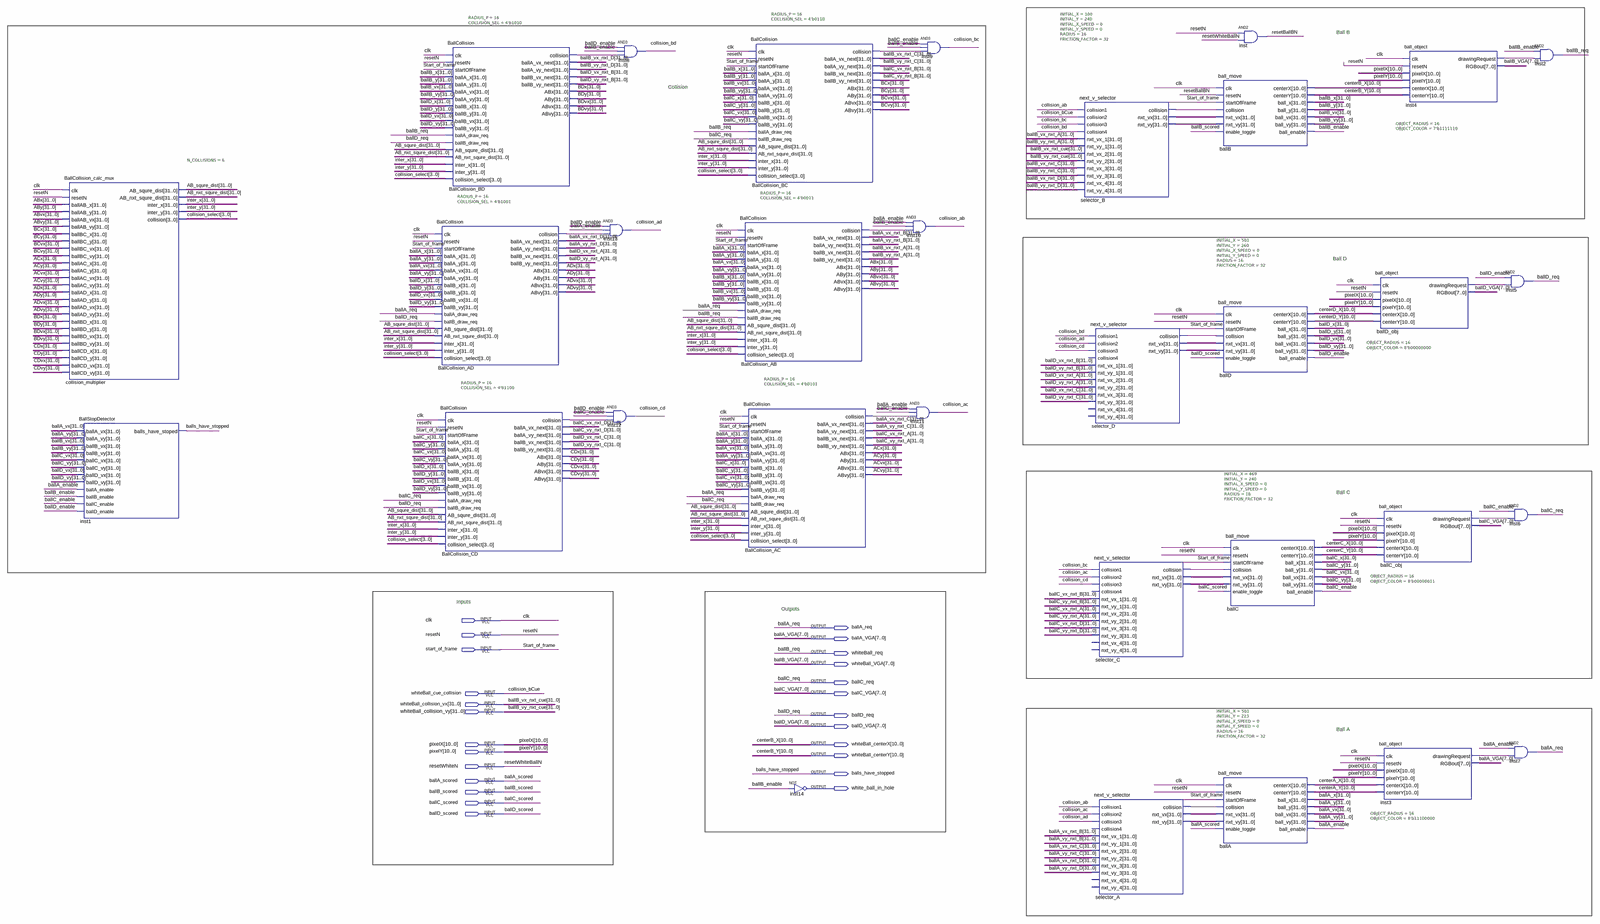
[diagram p0: schematic sheet, whole]
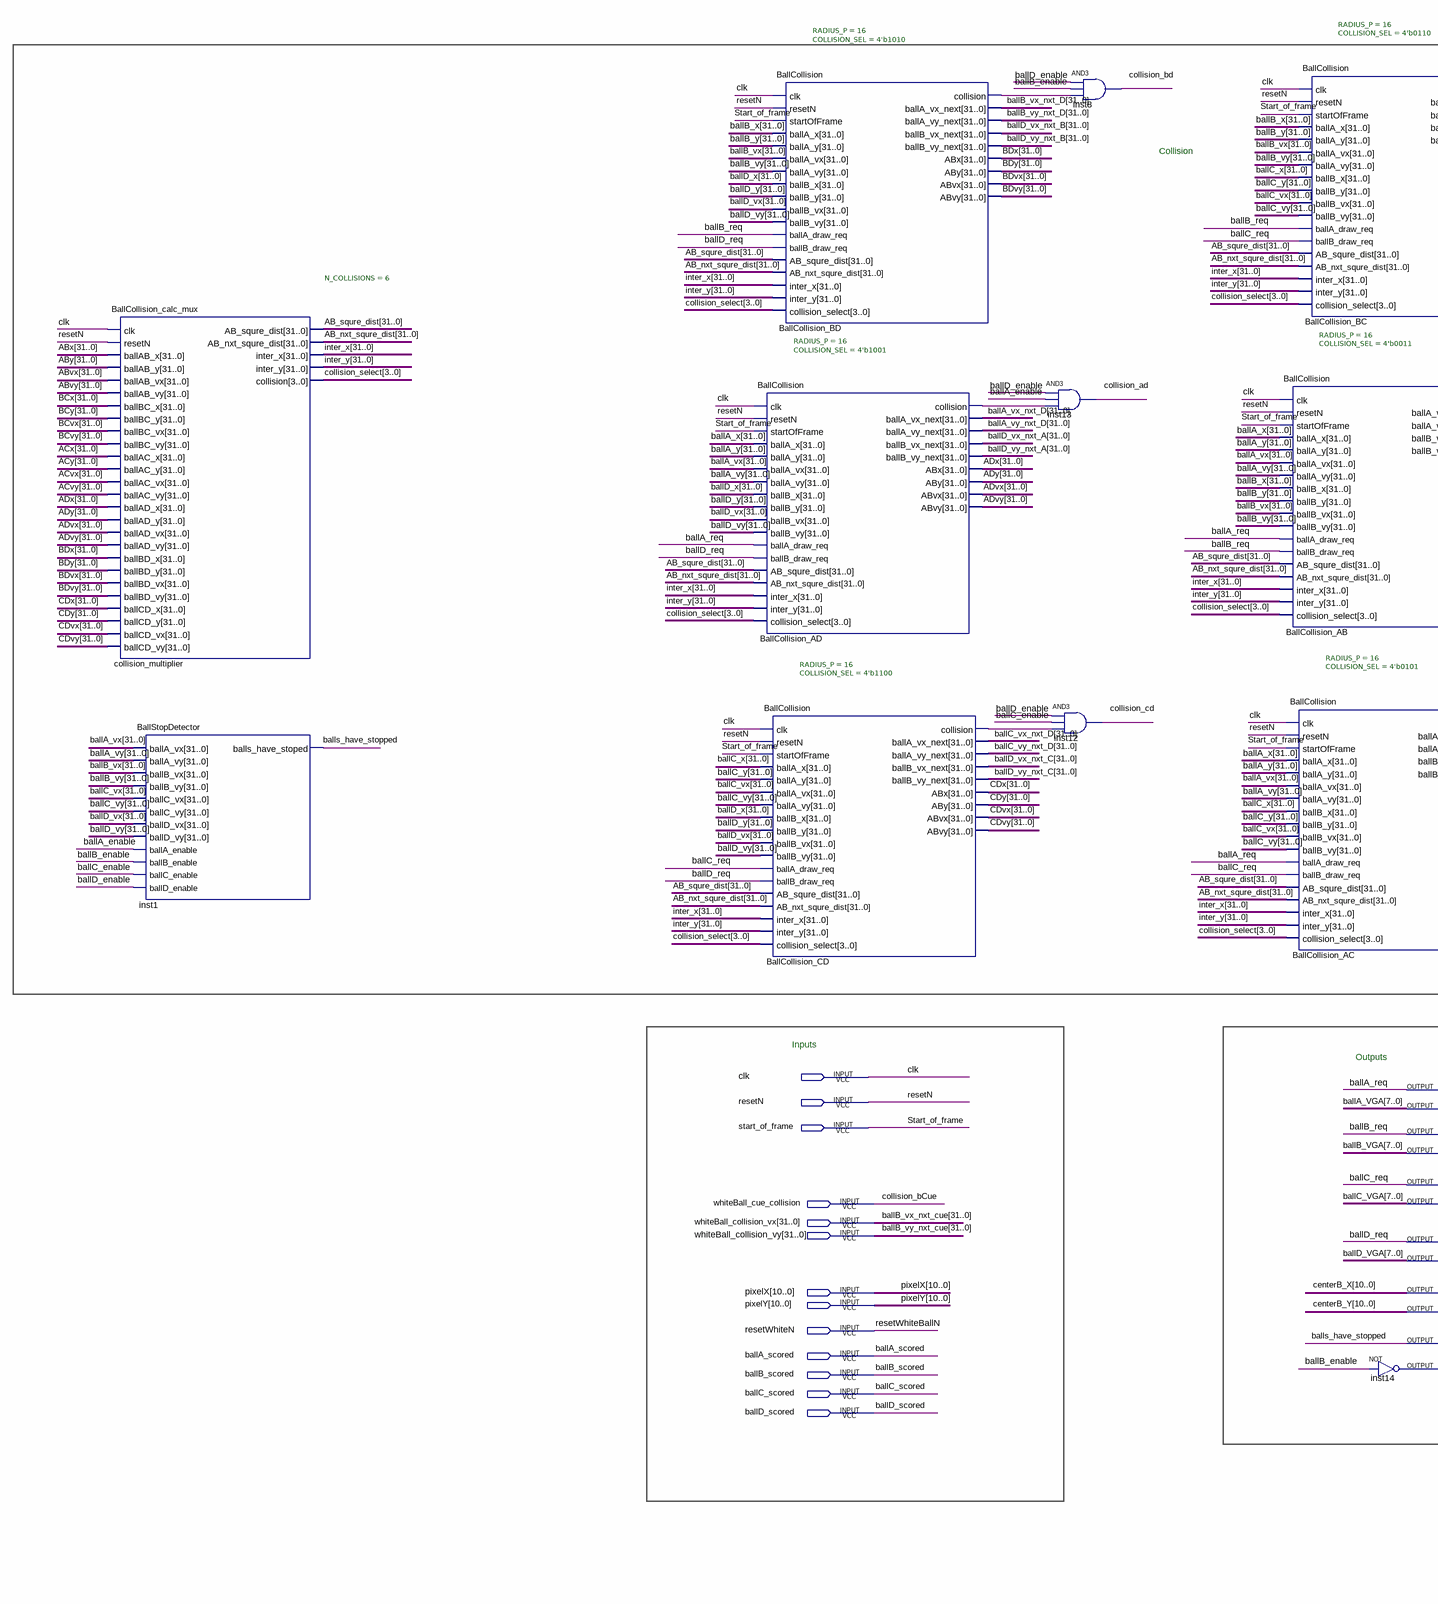
[diagram p1: schematic sheet, left part]
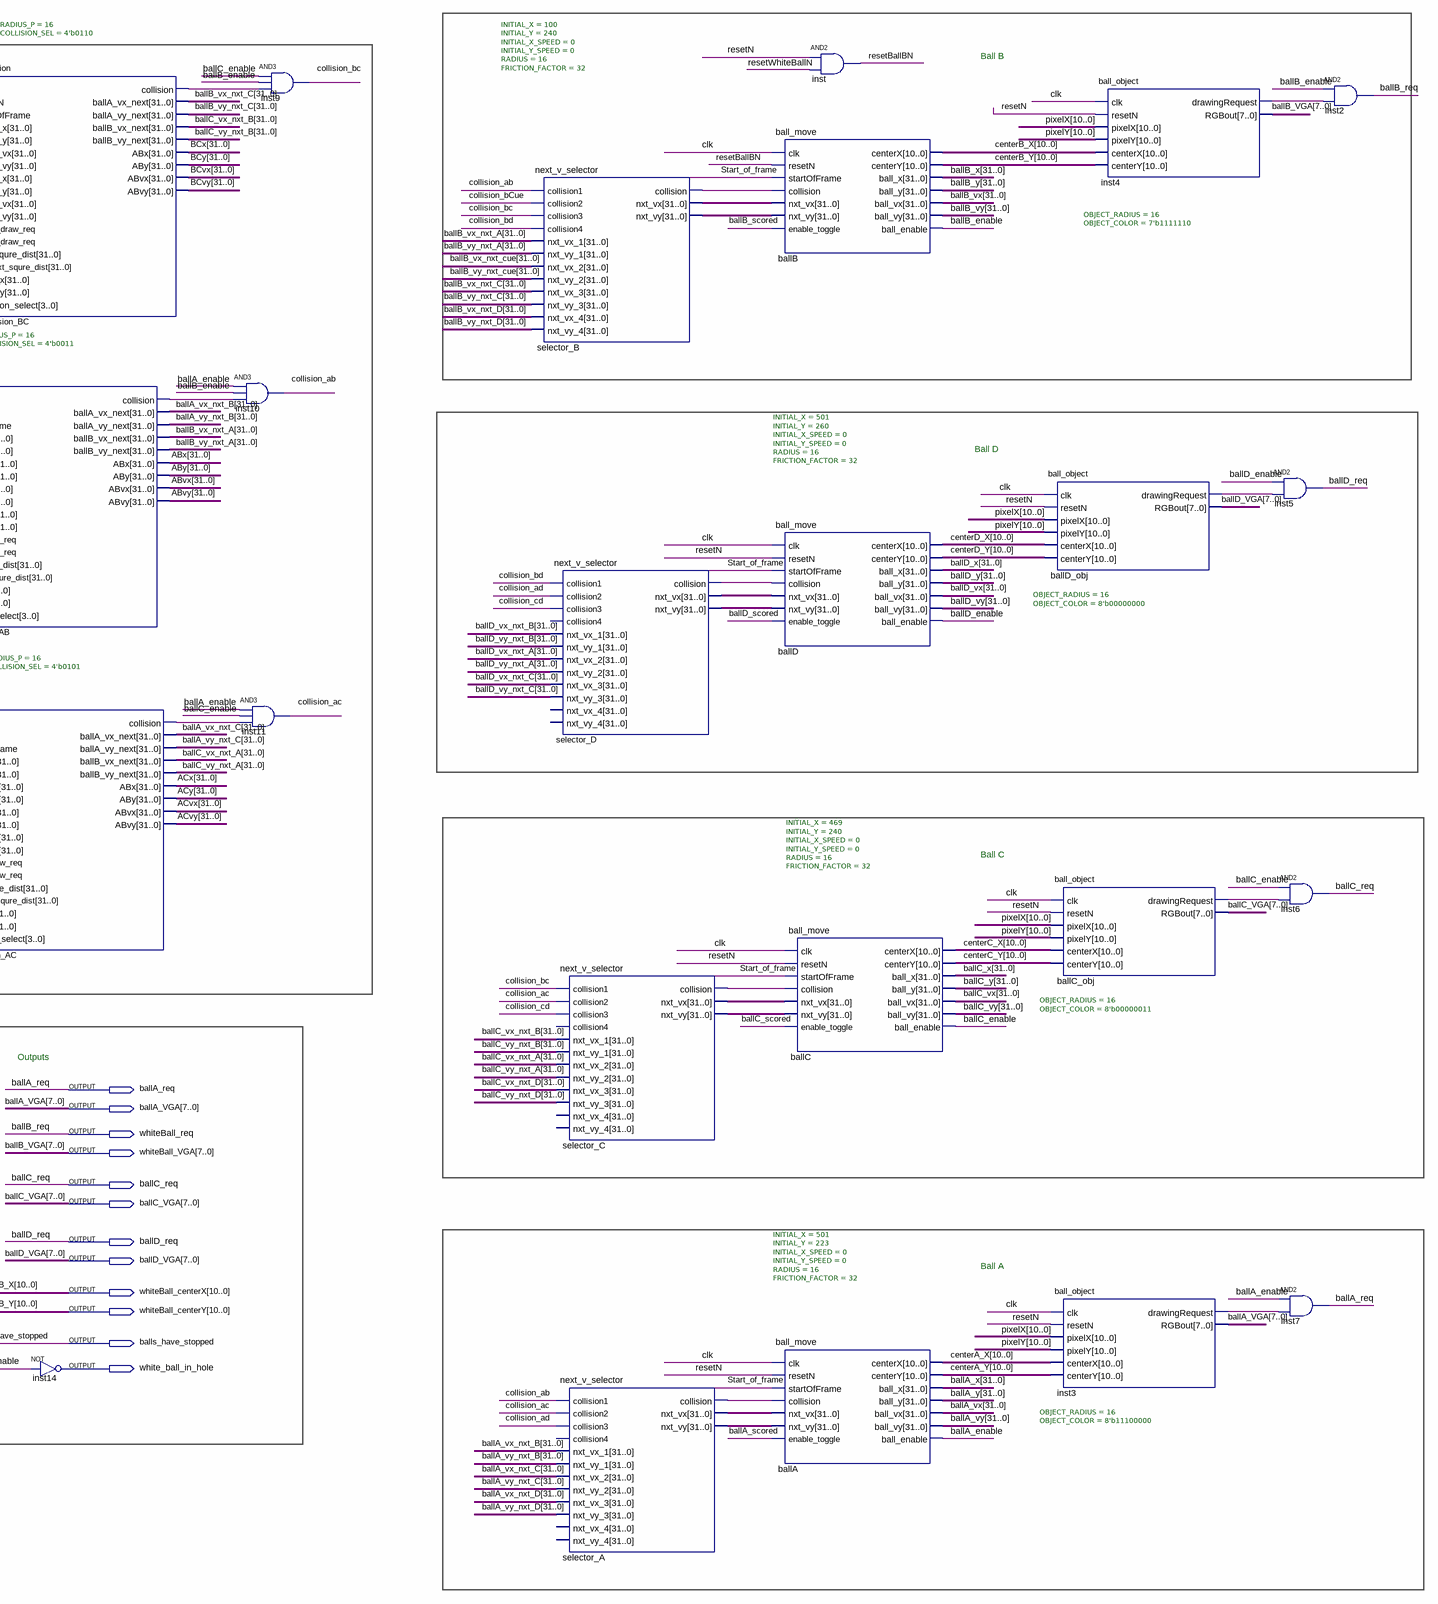
[diagram p2: schematic sheet, right part]
// Quartus schematic BALLS_TOP.bdf as structural Verilog: 32 symbols, 25 pins
module BALLS_TOP (
  input  clk,
  input  resetN,
  input  start_of_frame,
  input  whiteBall_cue_collision,
  input  [31:0] whiteBall_collision_vx,
  input  [31:0] whiteBall_collision_vy,
  input  [10:0] pixelX,
  input  [10:0] pixelY,
  input  resetWhiteN,
  input  ballA_scored,
  input  ballB_scored,
  input  ballC_scored,
  input  ballD_scored,
  output ballA_req,
  output [7:0] ballA_VGA,
  output whiteBall_req,
  output [7:0] whiteBall_VGA,
  output ballC_req,
  output [7:0] ballC_VGA,
  output ballD_req,
  output [7:0] ballD_VGA,
  output [10:0] whiteBall_centerX,
  output [10:0] whiteBall_centerY,
  output balls_have_stopped,
  output white_ball_in_hole
);

  wire ballA_enable, ballB_enable, ballC_enable, ballC_obj_drawingrequest, BallCollision_AB_collision,
       BallCollision_AC_collision, BallCollision_AD_collision, BallCollision_BC_collision,
       BallCollision_BD_collision, BallCollision_CD_collision, ballD_enable, ballD_obj_drawingrequest,
       collision_ab, collision_ac, collision_ad, collision_bc, collision_bd, collision_cd,
       inst3_drawingrequest, inst4_drawingrequest, resetBallBN, selector_A_collision, selector_B_collision,
       selector_C_collision, selector_D_collision;
  wire [3:0] collision_select;
  wire [10:0] centerA_X, centerA_Y, centerC_X, centerC_Y, centerD_X, centerD_Y;
  wire [31:0] AB_nxt_squre_dist, AB_squre_dist, ABvx, ABvy, ABx, ABy, ACvx, ACvy, ACx, ACy, ADvx, ADvy, ADx,
       ADy, ballA_vx, ballA_vx_nxt_B, ballA_vx_nxt_C, ballA_vx_nxt_D, ballA_vy, ballA_vy_nxt_B,
       ballA_vy_nxt_C, ballA_vy_nxt_D, ballA_x, ballA_y, ballB_vx, ballB_vx_nxt_A, ballB_vx_nxt_C,
       ballB_vx_nxt_D, ballB_vy, ballB_vy_nxt_A, ballB_vy_nxt_C, ballB_vy_nxt_D, ballB_x, ballB_y, ballC_vx,
       ballC_vx_nxt_A, ballC_vx_nxt_B, ballC_vx_nxt_D, ballC_vy, ballC_vy_nxt_A, ballC_vy_nxt_B,
       ballC_vy_nxt_D, ballC_x, ballC_y, ballD_vx, ballD_vx_nxt_A, ballD_vx_nxt_B, ballD_vx_nxt_C, ballD_vy,
       ballD_vy_nxt_A, ballD_vy_nxt_B, ballD_vy_nxt_C, ballD_x, ballD_y, BCvx, BCvy, BCx, BCy, BDvx, BDvy,
       BDx, BDy, CDvx, CDvy, CDx, CDy, inter_x, inter_y, selector_A_nxt_vx, selector_A_nxt_vy,
       selector_B_nxt_vx, selector_B_nxt_vy, selector_C_nxt_vx, selector_C_nxt_vy, selector_D_nxt_vx,
       selector_D_nxt_vy;

  BallCollision_calc_mux #(.N_COLLISIONS(6)) collision_multiplier (
    .clk(clk), .resetN(resetN), .ballAB_x(ABx), .ballAB_y(ABy), .ballAB_vx(ABvx), .ballAB_vy(ABvy),
    .ballBC_x(BCx), .ballBC_y(BCy), .ballBC_vx(BCvx), .ballBC_vy(BCvy), .ballAC_x(ACx), .ballAC_y(ACy),
    .ballAC_vx(ACvx), .ballAC_vy(ACvy), .ballAD_x(ADx), .ballAD_y(ADy), .ballAD_vx(ADvx), .ballAD_vy(ADvy),
    .ballBD_x(BDx), .ballBD_y(BDy), .ballBD_vx(BDvx), .ballBD_vy(BDvy), .ballCD_x(CDx), .ballCD_y(CDy),
    .ballCD_vx(CDvx), .ballCD_vy(CDvy), .AB_squre_dist(AB_squre_dist), .AB_nxt_squre_dist(AB_nxt_squre_dist),
    .inter_x(inter_x), .inter_y(inter_y), .collision(collision_select));
  BallStopDetector inst1 (
    .ballA_vx(ballA_vx), .ballA_vy(ballA_vy), .ballB_vx(ballB_vx), .ballB_vy(ballB_vy), .ballC_vx(ballC_vx),
    .ballC_vy(ballC_vy), .ballD_vx(ballD_vx), .ballD_vy(ballD_vy), .ballA_enable(ballA_enable),
    .ballB_enable(ballB_enable), .ballC_enable(ballC_enable), .ballD_enable(ballD_enable),
    .balls_have_stoped(balls_have_stopped));
  BallCollision #(.RADIUS_P(16), .COLLISION_SEL(4'b1001)) BallCollision_AD (
    .clk(clk), .resetN(resetN), .startOfFrame(start_of_frame), .ballA_x(ballA_x), .ballA_y(ballA_y),
    .ballA_vx(ballA_vx), .ballA_vy(ballA_vy), .ballB_x(ballD_x), .ballB_y(ballD_y), .ballB_vx(ballD_vx),
    .ballB_vy(ballD_vy), .ballA_draw_req(ballA_req), .ballB_draw_req(ballD_req),
    .AB_squre_dist(AB_squre_dist), .AB_nxt_squre_dist(AB_nxt_squre_dist), .inter_x(inter_x),
    .inter_y(inter_y), .collision_select(collision_select), .collision(BallCollision_AD_collision),
    .ballA_vx_next(ballA_vx_nxt_D), .ballA_vy_next(ballA_vy_nxt_D), .ballB_vx_next(ballD_vx_nxt_A),
    .ballB_vy_next(ballD_vy_nxt_A), .ABx(ADx), .ABy(ADy), .ABvx(ADvx), .ABvy(ADvy));
  BallCollision #(.RADIUS_P(16), .COLLISION_SEL(4'b1100)) BallCollision_CD (
    .clk(clk), .resetN(resetN), .startOfFrame(start_of_frame), .ballA_x(ballC_x), .ballA_y(ballC_y),
    .ballA_vx(ballC_vx), .ballA_vy(ballC_vy), .ballB_x(ballD_x), .ballB_y(ballD_y), .ballB_vx(ballD_vx),
    .ballB_vy(ballD_vy), .ballA_draw_req(ballC_req), .ballB_draw_req(ballD_req),
    .AB_squre_dist(AB_squre_dist), .AB_nxt_squre_dist(AB_nxt_squre_dist), .inter_x(inter_x),
    .inter_y(inter_y), .collision_select(collision_select), .collision(BallCollision_CD_collision),
    .ballA_vx_next(ballC_vx_nxt_D), .ballA_vy_next(ballC_vy_nxt_D), .ballB_vx_next(ballD_vx_nxt_C),
    .ballB_vy_next(ballD_vy_nxt_C), .ABx(CDx), .ABy(CDy), .ABvx(CDvx), .ABvy(CDvy));
  BallCollision #(.RADIUS_P(16), .COLLISION_SEL(4'b1010)) BallCollision_BD (
    .clk(clk), .resetN(resetN), .startOfFrame(start_of_frame), .ballA_x(ballB_x), .ballA_y(ballB_y),
    .ballA_vx(ballB_vx), .ballA_vy(ballB_vy), .ballB_x(ballD_x), .ballB_y(ballD_y), .ballB_vx(ballD_vx),
    .ballB_vy(ballD_vy), .ballA_draw_req(whiteBall_req), .ballB_draw_req(ballD_req),
    .AB_squre_dist(AB_squre_dist), .AB_nxt_squre_dist(AB_nxt_squre_dist), .inter_x(inter_x),
    .inter_y(inter_y), .collision_select(collision_select), .collision(BallCollision_BD_collision),
    .ballA_vx_next(ballB_vx_nxt_D), .ballA_vy_next(ballB_vy_nxt_D), .ballB_vx_next(ballD_vx_nxt_B),
    .ballB_vy_next(ballD_vy_nxt_B), .ABx(BDx), .ABy(BDy), .ABvx(BDvx), .ABvy(BDvy));
  and inst13 (collision_ad, ballD_enable, ballA_enable, BallCollision_AD_collision);
  and inst12 (collision_cd, ballD_enable, ballC_enable, BallCollision_CD_collision);
  and inst8 (collision_bd, ballD_enable, ballB_enable, BallCollision_BD_collision);
  BallCollision #(.RADIUS_P(16), .COLLISION_SEL(4'b0110)) BallCollision_BC (
    .clk(clk), .resetN(resetN), .startOfFrame(start_of_frame), .ballA_x(ballB_x), .ballA_y(ballB_y),
    .ballA_vx(ballB_vx), .ballA_vy(ballB_vy), .ballB_x(ballC_x), .ballB_y(ballC_y), .ballB_vx(ballC_vx),
    .ballB_vy(ballC_vy), .ballA_draw_req(whiteBall_req), .ballB_draw_req(ballC_req),
    .AB_squre_dist(AB_squre_dist), .AB_nxt_squre_dist(AB_nxt_squre_dist), .inter_x(inter_x),
    .inter_y(inter_y), .collision_select(collision_select), .collision(BallCollision_BC_collision),
    .ballA_vx_next(ballB_vx_nxt_C), .ballA_vy_next(ballB_vy_nxt_C), .ballB_vx_next(ballC_vx_nxt_B),
    .ballB_vy_next(ballC_vy_nxt_B), .ABx(BCx), .ABy(BCy), .ABvx(BCvx), .ABvy(BCvy));
  BallCollision #(.RADIUS_P(16), .COLLISION_SEL(4'b0011)) BallCollision_AB (
    .clk(clk), .resetN(resetN), .startOfFrame(start_of_frame), .ballA_x(ballA_x), .ballA_y(ballA_y),
    .ballA_vx(ballA_vx), .ballA_vy(ballA_vy), .ballB_x(ballB_x), .ballB_y(ballB_y), .ballB_vx(ballB_vx),
    .ballB_vy(ballB_vy), .ballA_draw_req(ballA_req), .ballB_draw_req(whiteBall_req),
    .AB_squre_dist(AB_squre_dist), .AB_nxt_squre_dist(AB_nxt_squre_dist), .inter_x(inter_x),
    .inter_y(inter_y), .collision_select(collision_select), .collision(BallCollision_AB_collision),
    .ballA_vx_next(ballA_vx_nxt_B), .ballA_vy_next(ballA_vy_nxt_B), .ballB_vx_next(ballB_vx_nxt_A),
    .ballB_vy_next(ballB_vy_nxt_A), .ABx(ABx), .ABy(ABy), .ABvx(ABvx), .ABvy(ABvy));
  BallCollision #(.RADIUS_P(16), .COLLISION_SEL(4'b0101)) BallCollision_AC (
    .clk(clk), .resetN(resetN), .startOfFrame(start_of_frame), .ballA_x(ballA_x), .ballA_y(ballA_y),
    .ballA_vx(ballA_vx), .ballA_vy(ballA_vy), .ballB_x(ballC_x), .ballB_y(ballC_y), .ballB_vx(ballC_vx),
    .ballB_vy(ballC_vy), .ballA_draw_req(ballA_req), .ballB_draw_req(ballC_req),
    .AB_squre_dist(AB_squre_dist), .AB_nxt_squre_dist(AB_nxt_squre_dist), .inter_x(inter_x),
    .inter_y(inter_y), .collision_select(collision_select), .collision(BallCollision_AC_collision),
    .ballA_vx_next(ballA_vx_nxt_C), .ballA_vy_next(ballA_vy_nxt_C), .ballB_vx_next(ballC_vx_nxt_A),
    .ballB_vy_next(ballC_vy_nxt_A), .ABx(ACx), .ABy(ACy), .ABvx(ACvx), .ABvy(ACvy));
  not inst14 (white_ball_in_hole, ballB_enable);
  and inst10 (collision_ab, ballA_enable, ballB_enable, BallCollision_AB_collision);
  and inst9 (collision_bc, ballC_enable, ballB_enable, BallCollision_BC_collision);
  and inst11 (collision_ac, ballA_enable, ballC_enable, BallCollision_AC_collision);
  next_v_selector selector_B (
    .collision1(collision_ab), .collision2(whiteBall_cue_collision), .collision3(collision_bc),
    .collision4(collision_bd), .nxt_vx_1(ballB_vx_nxt_A), .nxt_vy_1(ballB_vy_nxt_A),
    .nxt_vx_2(whiteBall_collision_vx), .nxt_vy_2(whiteBall_collision_vy), .nxt_vx_3(ballB_vx_nxt_C),
    .nxt_vy_3(ballB_vy_nxt_C), .nxt_vx_4(ballB_vx_nxt_D), .nxt_vy_4(ballB_vy_nxt_D),
    .collision(selector_B_collision), .nxt_vx(selector_B_nxt_vx), .nxt_vy(selector_B_nxt_vy));
  next_v_selector selector_D (
    .collision1(collision_bd), .collision2(collision_ad), .collision3(collision_cd),
    .nxt_vx_1(ballD_vx_nxt_B), .nxt_vy_1(ballD_vy_nxt_B), .nxt_vx_2(ballD_vx_nxt_A),
    .nxt_vy_2(ballD_vy_nxt_A), .nxt_vx_3(ballD_vx_nxt_C), .nxt_vy_3(ballD_vy_nxt_C),
    .collision(selector_D_collision), .nxt_vx(selector_D_nxt_vx), .nxt_vy(selector_D_nxt_vy));  // open: collision4, nxt_vx_4, nxt_vy_4
  next_v_selector selector_C (
    .collision1(collision_bc), .collision2(collision_ac), .collision3(collision_cd),
    .nxt_vx_1(ballC_vx_nxt_B), .nxt_vy_1(ballC_vy_nxt_B), .nxt_vx_2(ballC_vx_nxt_A),
    .nxt_vy_2(ballC_vy_nxt_A), .nxt_vx_3(ballC_vx_nxt_D), .nxt_vy_3(ballC_vy_nxt_D),
    .collision(selector_C_collision), .nxt_vx(selector_C_nxt_vx), .nxt_vy(selector_C_nxt_vy));  // open: collision4, nxt_vx_4, nxt_vy_4
  next_v_selector selector_A (
    .collision1(collision_ab), .collision2(collision_ac), .collision3(collision_ad),
    .nxt_vx_1(ballA_vx_nxt_B), .nxt_vy_1(ballA_vy_nxt_B), .nxt_vx_2(ballA_vx_nxt_C),
    .nxt_vy_2(ballA_vy_nxt_C), .nxt_vx_3(ballA_vx_nxt_D), .nxt_vy_3(ballA_vy_nxt_D),
    .collision(selector_A_collision), .nxt_vx(selector_A_nxt_vx), .nxt_vy(selector_A_nxt_vy));  // open: collision4, nxt_vx_4, nxt_vy_4
  ball_move #(.INITIAL_X(100), .INITIAL_Y(240), .INITIAL_X_SPEED(0), .INITIAL_Y_SPEED(0), .RADIUS(16), .FRICTION_FACTOR(32)) ballB (
    .clk(clk), .resetN(resetBallBN), .startOfFrame(start_of_frame), .collision(selector_B_collision),
    .nxt_vx(selector_B_nxt_vx), .nxt_vy(selector_B_nxt_vy), .enable_toggle(ballB_scored),
    .centerX(whiteBall_centerX), .centerY(whiteBall_centerY), .ball_x(ballB_x), .ball_y(ballB_y),
    .ball_vx(ballB_vx), .ball_vy(ballB_vy), .ball_enable(ballB_enable));
  ball_move #(.INITIAL_X(501), .INITIAL_Y(260), .INITIAL_X_SPEED(0), .INITIAL_Y_SPEED(0), .RADIUS(16), .FRICTION_FACTOR(32)) ballD (
    .clk(clk), .resetN(resetN), .startOfFrame(start_of_frame), .collision(selector_D_collision),
    .nxt_vx(selector_D_nxt_vx), .nxt_vy(selector_D_nxt_vy), .enable_toggle(ballD_scored),
    .centerX(centerD_X), .centerY(centerD_Y), .ball_x(ballD_x), .ball_y(ballD_y), .ball_vx(ballD_vx),
    .ball_vy(ballD_vy), .ball_enable(ballD_enable));
  ball_move #(.INITIAL_X(469), .INITIAL_Y(240), .INITIAL_X_SPEED(0), .INITIAL_Y_SPEED(0), .RADIUS(16), .FRICTION_FACTOR(32)) ballC (
    .clk(clk), .resetN(resetN), .startOfFrame(start_of_frame), .collision(selector_C_collision),
    .nxt_vx(selector_C_nxt_vx), .nxt_vy(selector_C_nxt_vy), .enable_toggle(ballC_scored),
    .centerX(centerC_X), .centerY(centerC_Y), .ball_x(ballC_x), .ball_y(ballC_y), .ball_vx(ballC_vx),
    .ball_vy(ballC_vy), .ball_enable(ballC_enable));
  ball_move #(.INITIAL_X(501), .INITIAL_Y(223), .INITIAL_X_SPEED(0), .INITIAL_Y_SPEED(0), .RADIUS(16), .FRICTION_FACTOR(32)) ballA (
    .clk(clk), .resetN(resetN), .startOfFrame(start_of_frame), .collision(selector_A_collision),
    .nxt_vx(selector_A_nxt_vx), .nxt_vy(selector_A_nxt_vy), .enable_toggle(ballA_scored),
    .centerX(centerA_X), .centerY(centerA_Y), .ball_x(ballA_x), .ball_y(ballA_y), .ball_vx(ballA_vx),
    .ball_vy(ballA_vy), .ball_enable(ballA_enable));
  and inst (resetBallBN, resetN, resetWhiteN);
  ball_object #(.OBJECT_RADIUS(16), .OBJECT_COLOR(8'b00000000)) ballD_obj (
    .clk(clk), .resetN(resetN), .pixelX(pixelX), .pixelY(pixelY), .centerX(centerD_X), .centerY(centerD_Y),
    .drawingRequest(ballD_obj_drawingrequest), .RGBout(ballD_VGA));
  ball_object #(.OBJECT_RADIUS(16), .OBJECT_COLOR(7'b1111110)) inst4 (
    .clk(clk), .resetN(resetN), .pixelX(pixelX), .pixelY(pixelY), .centerX(whiteBall_centerX),
    .centerY(whiteBall_centerY), .drawingRequest(inst4_drawingrequest), .RGBout(whiteBall_VGA));
  ball_object #(.OBJECT_RADIUS(16), .OBJECT_COLOR(8'b00000011)) ballC_obj (
    .clk(clk), .resetN(resetN), .pixelX(pixelX), .pixelY(pixelY), .centerX(centerC_X), .centerY(centerC_Y),
    .drawingRequest(ballC_obj_drawingrequest), .RGBout(ballC_VGA));
  ball_object #(.OBJECT_RADIUS(16), .OBJECT_COLOR(8'b11100000)) inst3 (
    .clk(clk), .resetN(resetN), .pixelX(pixelX), .pixelY(pixelY), .centerX(centerA_X), .centerY(centerA_Y),
    .drawingRequest(inst3_drawingrequest), .RGBout(ballA_VGA));
  and inst5 (ballD_req, ballD_enable, ballD_obj_drawingrequest);
  and inst6 (ballC_req, ballC_enable, ballC_obj_drawingrequest);
  and inst7 (ballA_req, ballA_enable, inst3_drawingrequest);
  and inst2 (whiteBall_req, ballB_enable, inst4_drawingrequest);

  // Other names for the same wires on the sheet: ballB_req = whiteBall_req; ballB_VGA[7:0] = whiteBall_VGA;
  //   ballB_vx_nxt_cue[31:0] = whiteBall_collision_vx; ballB_vy_nxt_cue[31:0] = whiteBall_collision_vy;
  //   centerB_X[10:0] = whiteBall_centerX; centerB_Y[10:0] = whiteBall_centerY;
  //   collision_bCue = whiteBall_cue_collision; resetWhiteBallN = resetWhiteN

  // Notes on the sheet:
  //   Ball B
  //   Collision
  //   Ball D
  //   Ball C
  //   Inputs
  //   Outputs
  //   Ball A
endmodule
